# Altium schematic sheet ARC-S-USB.SchDoc
size A4
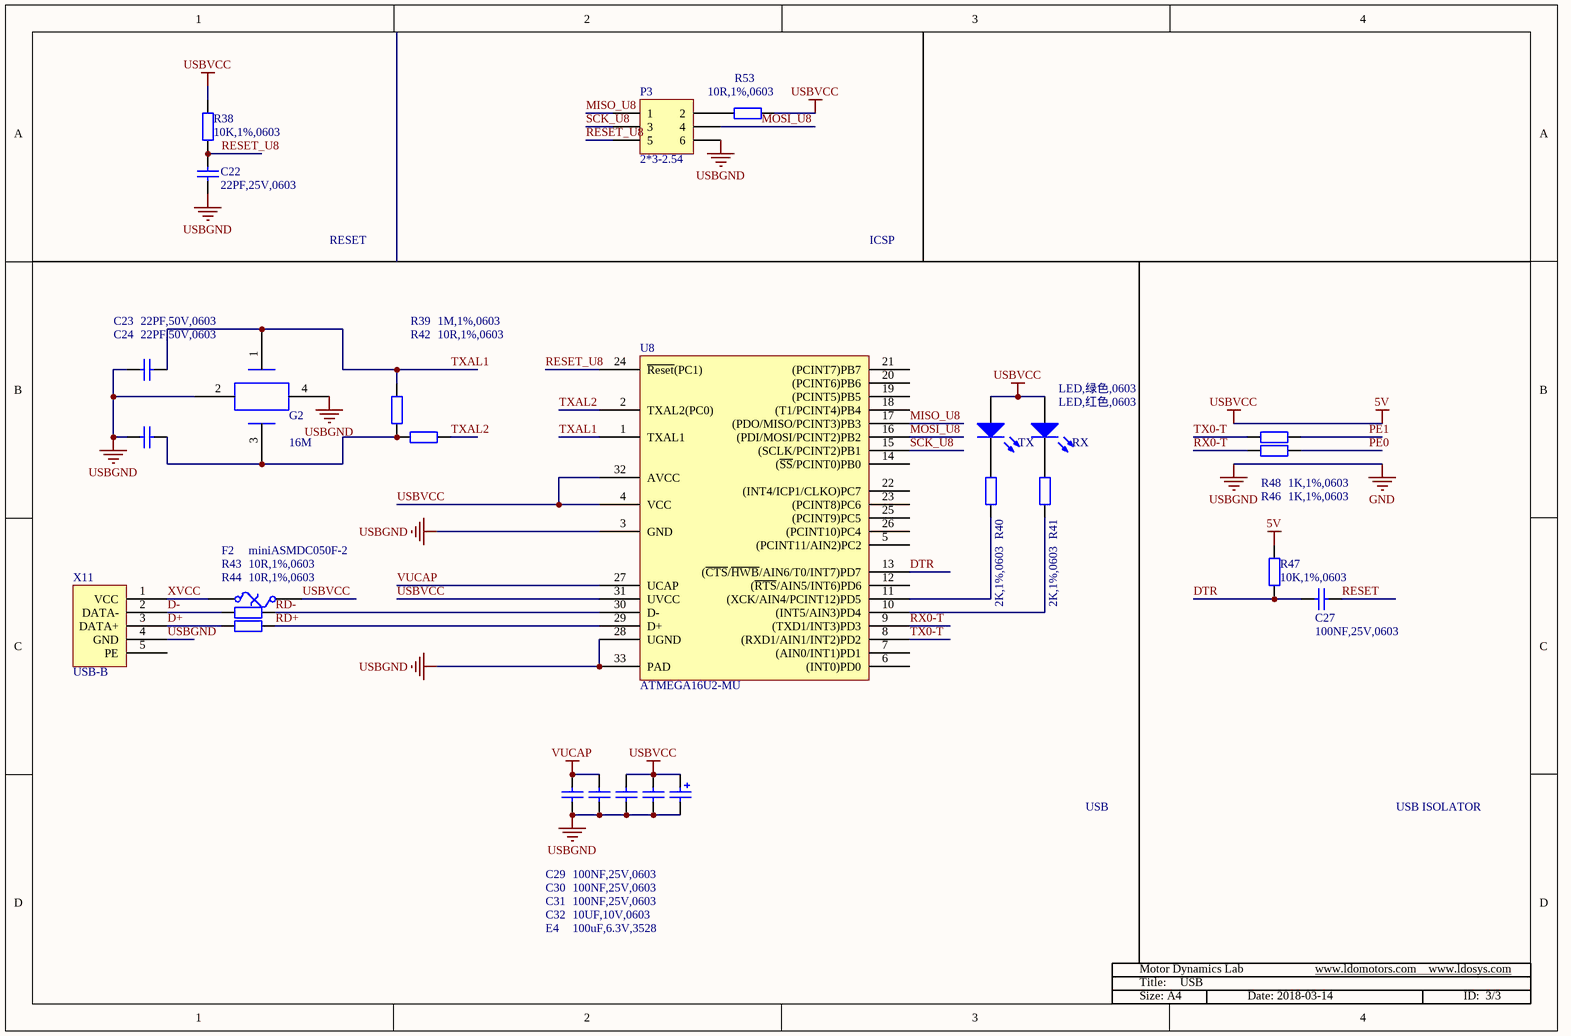
[diagram p0: ARC-S-USB.SchDoc]

## Parts
C22  22PF,25V,0603  [RC0603]
C23  22PF,50V,0603  [RC0603]
C24  22PF,50V,0603  [RC0603]
C27  100NF,25V,0603  [RC0603]
C29  100NF,25V,0603  [RC0603]
C30  100NF,25V,0603  [RC0603]
C31  100NF,25V,0603  [RC0603]
C32  10UF,10V,0603  [RC0603]
E4  100uF,6.3V,3528  [3528-21]
F2  miniASMDC050F-2  [RC1812]
G2  16M  [Y-3225]
P3  2*3-2.54  [HDR2X3]
R38  10K,1%,0603  [RC0603]
R39  1M,1%,0603  [RC0603]
R40  2K,1%,0603  [RC0603]
R41  2K,1%,0603  [RC0603]
R42  10R,1%,0603  [RC0603]
R43  10R,1%,0603  [RC0603]
R44  10R,1%,0603  [RC0603]
R46  1K,1%,0603  [RC0603]
R47  10K,1%,0603  [RC0603]
R48  1K,1%,0603  [RC0603]
R53  10R,1%,0603  [RC0603]
RX  LED,红色,0603  [LED-0603]
TX  LED,绿色,0603  [LED-0603]
U8  ATMEGA16U2-MU  [QFN-32]
X11  USB-B  [USB-B90]

## Nets
USBGND: C22.2 C23.2 C24.2 C29.1 C30.1 C31.1 C32.1 E4.2 G2.2 G2.4 P3.6 U8.3(GND) U8.28(UGND) U8.33(PAD) X11.4(GND)  [also labelled GND]
USBVCC: C31.2 C32.2 E4.1 F2.2 R38.1 R47.2 R53.1 RX.1(A) TX.1(A) U8.4(VCC) U8.31(UVCC) U8.32(AVCC)  [also labelled 5V]
VUCAP: C29.2 C30.2 U8.27(UCAP)
D+: R44.1 X11.3(DATA+)
D-: R43.1 X11.2(DATA-)
DTR: C27.2 R47.1 U8.13((~{CTS}/~{HWB}/AIN6/T0/INT7)PD7)
MISO_U8: P3.1 U8.17((PDO/MISO/PCINT3)PB3)
MOSI_U8: P3.4 U8.16((PDI/MOSI/PCINT2)PB2)
PE0: R46.1
PE1: R48.1
RD+: R44.2 U8.29(D+)
RD-: R43.2 U8.30(D-)
RESET: C27.1
RESET_U8: C22.1 P3.5 R38.2 U8.24(~{Reset}(PC1))
RX0-T: R46.2 U8.9((TXD1/INT3)PD3)
SCK_U8: P3.3 U8.15((SCLK/PCINT2)PB1)
TX0-T: R48.2 U8.8((RXD1/AIN1/INT2)PD2)
TXAL1: C23.1 G2.1 R39.1 U8.1(TXAL1)
TXAL2: R42.2 U8.2(TXAL2(PC0))
XVCC: F2.1 X11.1(VCC)
NetC24_1: C24.1 G2.3 R39.2 R42.1
NetP3_2: P3.2 R53.2
NetR40_1: R40.1 TX.2(K)
NetR40_2: R40.2 U8.11((XCK/AIN4/PCINT12)PD5)
NetR41_1: R41.1 RX.2(K)
NetR41_2: R41.2 U8.10((INT5/AIN3)PD4)

Not connected (* = marked no-connect by the designer): U8 5((PCINT11/AIN2)PC2) 6((INT0)PD0) 7((AIN0/INT1)PD1) 12((~{RTS}/AIN5/INT6)PD6) 14((~{SS}/PCINT0)PB0) 18((T1/PCINT4)PB4) 19((PCINT5)PB5) 20((PCINT6)PB6) 21((PCINT7)PB7) 22((INT4/ICP1/CLKO)PC7) 23((PCINT8)PC6) 25((PCINT9)PC5) 26((PCINT10)PC4); X11 5(PE)

## Notes on the sheet
- RESET
- ICSP
- USB
- USB ISOLATOR
- Title:
- Motor Dynamics Lab
- www.ldomotors.com    www.ldosys.com
- Size: A4
- Date: 2018-03-14
- ID:  3/3

## Library data of the parts
C22-C24 C27 C29-C32 = Cap: Capacitor; Value: 100pF; Published: 8-Jun-2000; LatestRevisionDate: 17-Jul-2002; LatestRevisionNote: Re-released for DXP Platform.; PackageReference: RAD-0.3; Publisher: Altium Limited; PackageDescription: Radial Cap, Thru-Hole; 2 Leads; 0.3 in Pin Spacing
E4 = Cap Pol2: Polarized Capacitor (Axial); Published: 8-Jun-2000; LatestRevisionDate: 17-Jul-2002; LatestRevisionNote: Re-released for DXP Platform.; PackageReference: POLAR0.8; Publisher: Altium Limited; PackageDescription: Polarized Capacitor; 2 Leads; Value: 100uF,6.3V,3528
F2 = Fuse Thermal: Thermal Fuse; Published: 24-Mar-1999; LatestRevisionDate: 17-Jul-2002; LatestRevisionNote: Re-released for DXP Platform.; PackageReference: PIN-W2/E2.8; Publisher: Altium Limited; PackageDescription: Thru-Hole; 2 Leads
G2 = G
P3 = Header 3X2: Header, 3-Pin, Dual row; LatestRevisionDate: 17-Jul-2002; LatestRevisionNote: Re-released for DXP Platform.; Publisher: Altium Limited
R38-R44 R47 R53 = Res2: Resistor; Value: 1K; Published: 8-Jun-2000; LatestRevisionDate: 17-Jul-2002; LatestRevisionNote: Re-released for DXP Platform.; PackageReference: AXIAL-0.4; Publisher: Altium Limited; PackageDescription: Axial Device, Thru-Hole; 2 Leads; 0.4 in Pin Spacing
R46 R48 = Res2: Resistor; Published: 8-Jun-2000; LatestRevisionDate: 17-Jul-2002; LatestRevisionNote: Re-released for DXP Platform.; PackageReference: AXIAL-0.4; Publisher: Altium Limited; PackageDescription: Axial Device, Thru-Hole; 2 Leads; 0.4 in Pin Spacing; Value: 1K
RX TX = LED0: Typical INFRARED GaAs LED; Published: 8-Jun-2000; LatestRevisionDate: 08-Jul-2005; LatestRevisionNote: Mech Layer 1 removed.; PackageReference: LED-0; Publisher: Altium Limited; PackageDescription: LED; 2 Leads
U8 = ATMEGA8U2-MU
X11 = B-USC